# EasyEDA Pro project New Project_2023-08-31_08-25-03.eprj

# Schematic Schematic1
Create Date: 2023-08-31; Page Name: P1; Project Name: New Project_2023-08-31_08-25-03; Schematic Name: Schematic1; Update Date: 2023-08-31; Company: EasyEDA.com; Drawed: EasyEDA Pro; Page Size: A4; Part Number: JLCPCB-002; Reviewed: EasyEDA Pro; Version: V0.1
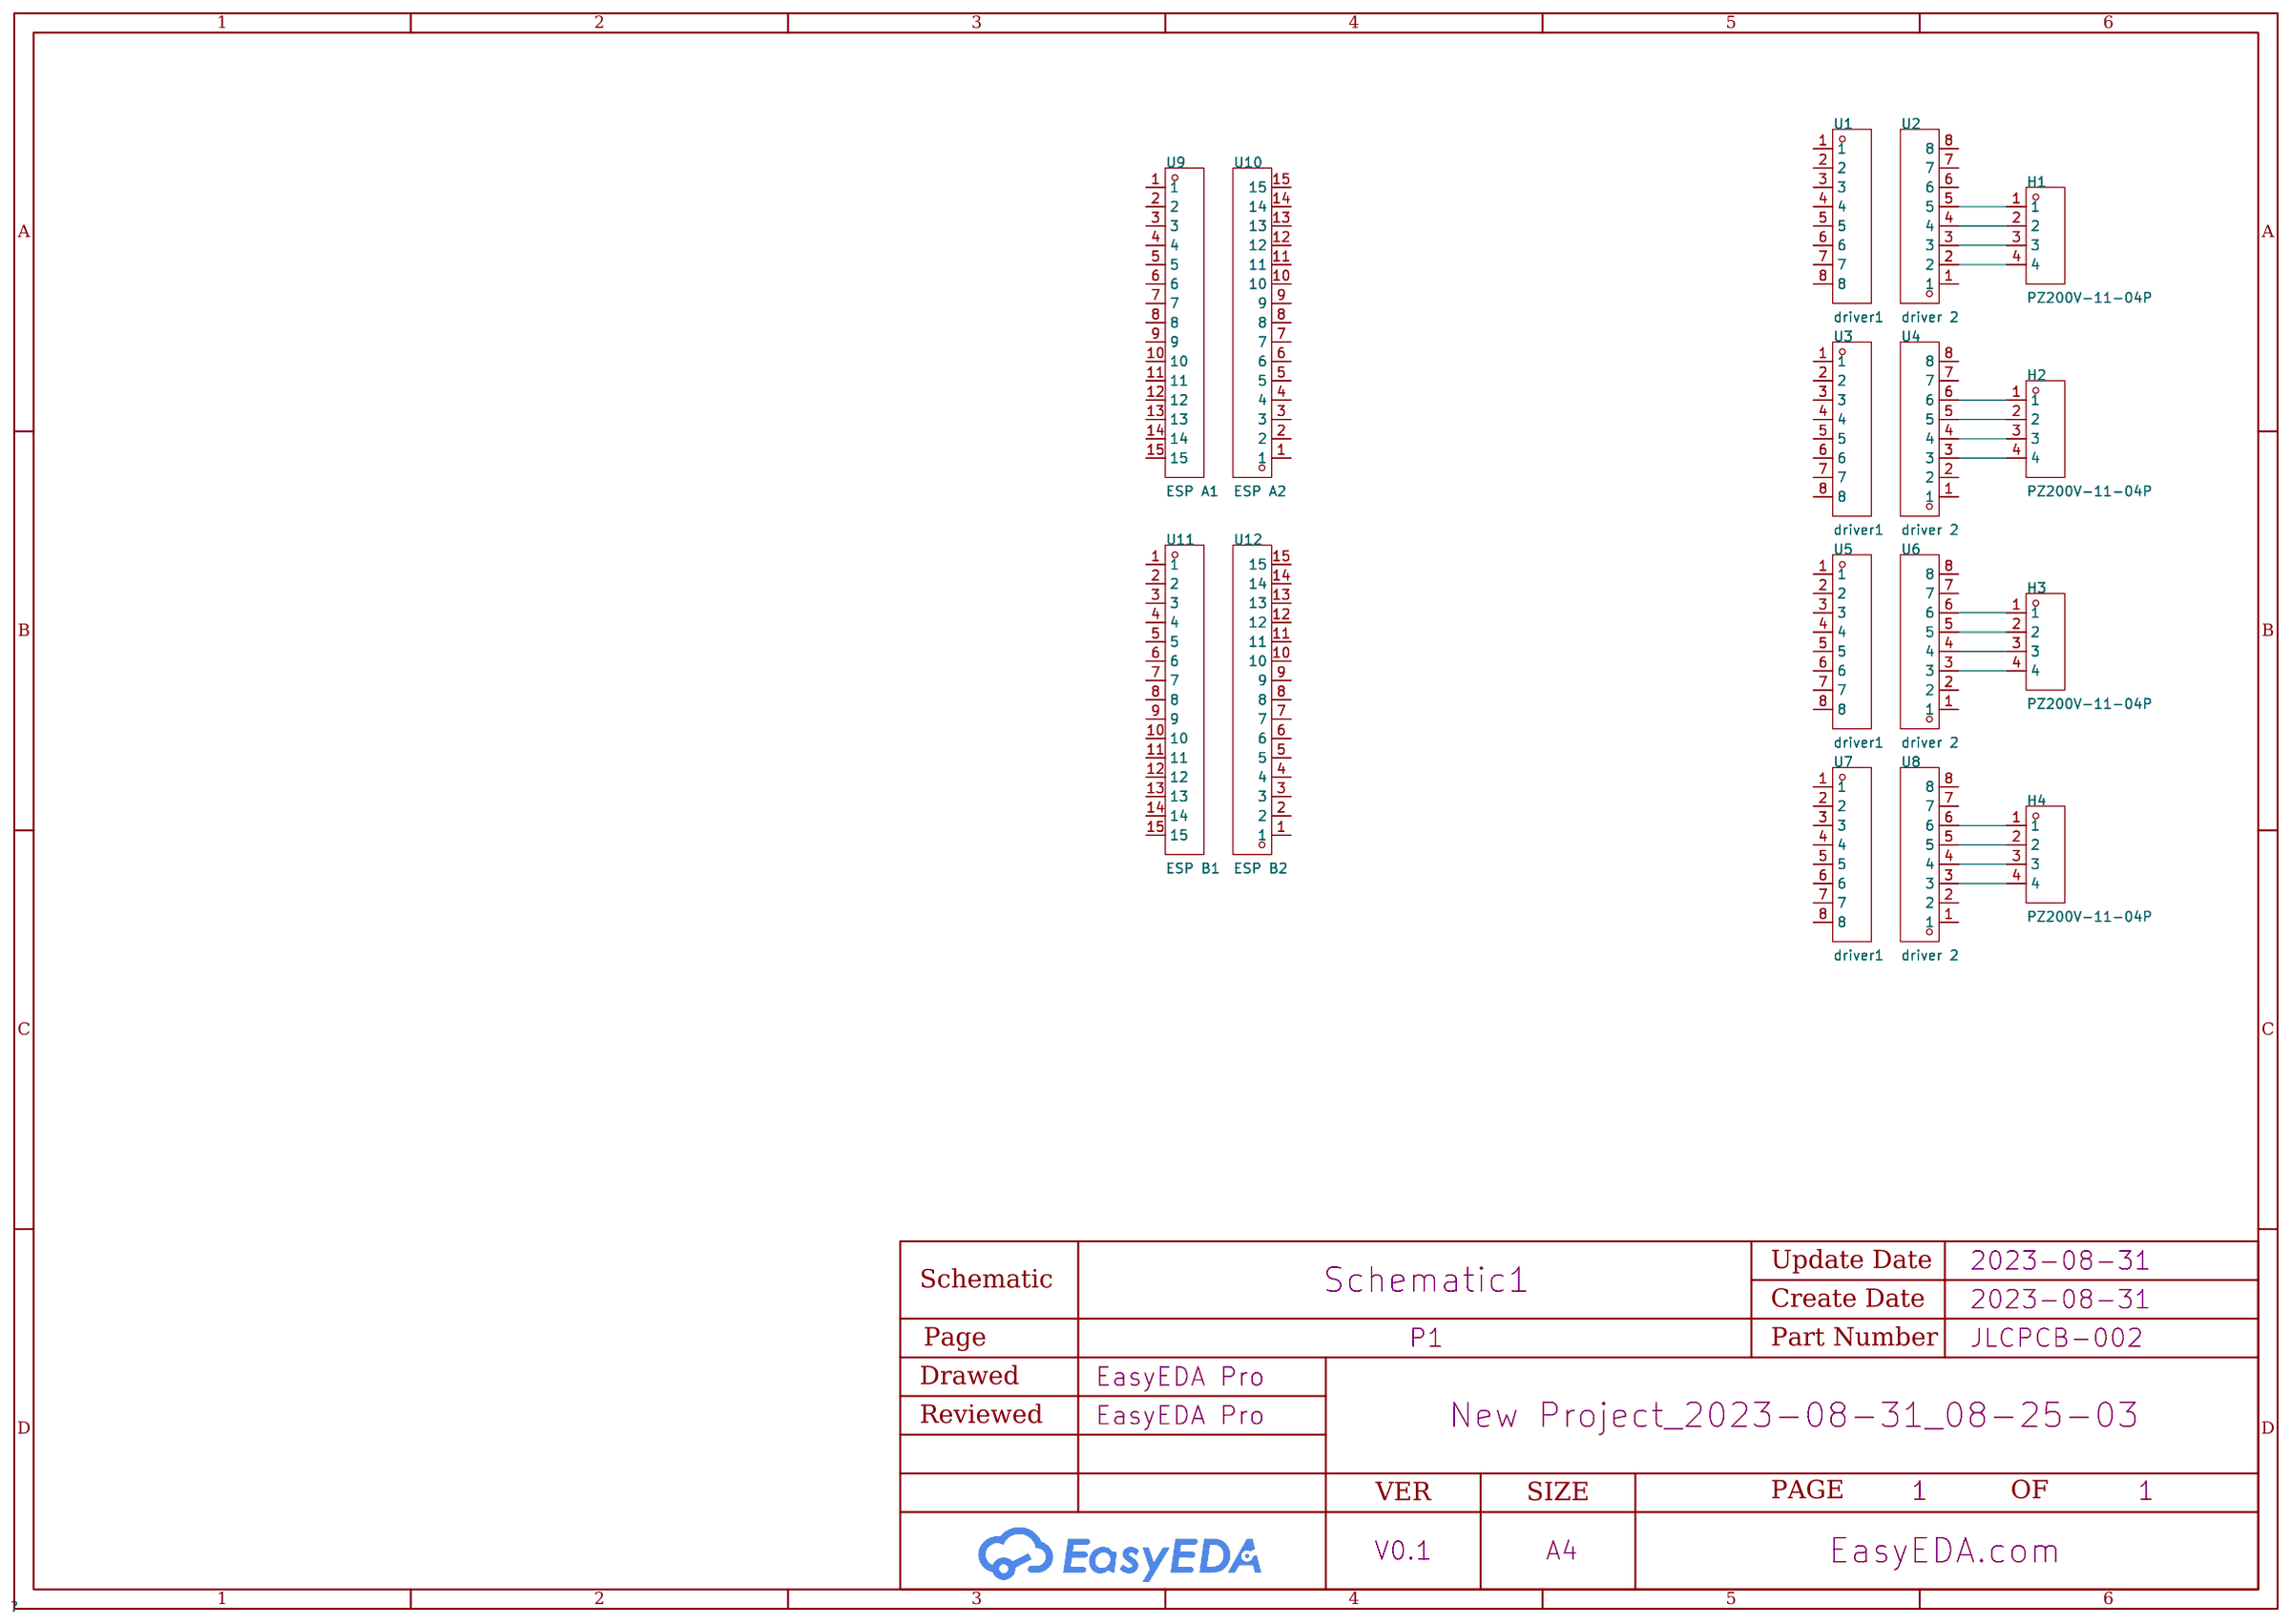
[diagram p0: schematic sheet]

## Parts
H1  PZ200V-11-04P  [HDR-TH_4P-P2.00-V-M]
H2  PZ200V-11-04P  [HDR-TH_4P-P2.00-V-M]
H3  PZ200V-11-04P  [HDR-TH_4P-P2.00-V-M]
H4  PZ200V-11-04P  [HDR-TH_4P-P2.00-V-M]
U1  driver1  [HDR-TH_8P-P2.54-V-F]
U2  driver 2  [HDR-TH_8P-P2.54-V-F]
U3  driver1  [HDR-TH_8P-P2.54-V-F]
U4  driver 2  [HDR-TH_8P-P2.54-V-F]
U5  driver1  [HDR-TH_8P-P2.54-V-F]
U6  driver 2  [HDR-TH_8P-P2.54-V-F]
U7  driver1  [HDR-TH_8P-P2.54-V-F]
U8  driver 2  [HDR-TH_8P-P2.54-V-F]
U9  ESP A1  [HDR-TH_15P-P2.54-V-F]
U10  ESP A2  [HDR-TH_15P-P2.54-V-F]
U11  ESP B1  [HDR-TH_15P-P2.54-V-F]
U12  ESP B2  [HDR-TH_15P-P2.54-V-F]

## Library data of the parts
H1-H4 = PZ200V-11-04P: Number of Rows:单排 Number of Pins:4 Pitch:2mm Pin Structure:1x4P Row Spacing:- Mounting Type:Straight Circluar Pins/Square Pins:Square Pins Current Rating (Max):- Voltage Rating (Max):- Length of Mating Pin:3.9mm Insulation Height:2mm Length of End Connect; LCSC Part Name: 2mm 1x4P 直插 方针; Supplier Part: C541858; Manufacturer: XFCN(兴飞); Supplier Footprint: 直插,P=2mm; JLCPCB Part Class: Extended Part; Supplier: LCSC; Number of Rows: 单排; Number of Pins: 4; Pitch: 2mm; Pin Structure: 1x4P; Mounting Type: Straight; Circluar Pins/Square Pins: Square Pins; Length of Mating Pin: 3.9mm; Insulation Height: 2mm; Length of End Connection Pin: 2.8mm; Operating Temperature Range: -40℃~+105℃; Color: Black
U1-U8 = FH-00882: Number of Rows:单排 Number of Holes:8 Pitch:2.54mm Holes Structure:1x8P Row Spacing:- Mounting Type:Straight Circular Hole / Square Hole:Square Holes Current Rating (Max):3A Voltage Rating (Max):- Holes Direction:Top Insulation Height:8.5mm Operating Temper; LCSC Part Name: 2.54mm 1x8P; Supplier Part: C2685213; Manufacturer: Liansheng(连盛); Supplier Footprint: 直插,P=2.54mm; JLCPCB Part Class: Extended Part; Supplier: LCSC; Number of Rows: 单排; Number of Holes: 8; Pitch: 2.54mm; Holes Structure: 1x8P; Mounting Type: Straight; Circular Hole / Square Hole: Square Holes; Current Rating (Max): 3A; Holes Direction: Top; Insulation Height: 8.5mm; Operating Temperature Range: -40℃~+105℃
U9-U12 = PM2.54-1*15: LCSC Part Name: 排母2.54 1*15 镀金环保; Supplier Part: C5371989; Manufacturer: ZHOURI(洲日); Supplier Footprint: 插件,P=2.54mm; Datasheet: https://atta.szlcsc.com/upload/public/pdf/source/20220729/3385E3C3A9122AF204A83235A2975C64.pdf; Supplier: LCSC

## Nets
Net-(H1-1): H1.1 U2.5
Net-(H1-2): H1.2 U2.4
Net-(H1-3): H1.3 U2.3
Net-(H1-4): H1.4 U2.2
Net-(H2-1): H2.1 U4.6
Net-(H2-2): H2.2 U4.5
Net-(H2-3): H2.3 U4.4
Net-(H2-4): H2.4 U4.3
Net-(H3-1): H3.1 U6.6
Net-(H3-2): H3.2 U6.5
Net-(H3-3): H3.3 U6.4
Net-(H3-4): H3.4 U6.3
Net-(H4-1): H4.1 U8.6
Net-(H4-2): H4.2 U8.5
Net-(H4-3): H4.3 U8.4
Net-(H4-4): H4.4 U8.3

Not connected (* = marked no-connect by the designer): U1 1 2 3 4 5 6 7 8; U2 1 6 7 8; U3 1 2 3 4 5 6 7 8; U4 1 2 7 8; U5 1 2 3 4 5 6 7 8; U6 1 2 7 8; U7 1 2 3 4 5 6 7 8; U8 1 2 7 8; U9 1 2 3 4 5 6 7 8 9 10 11 12 13 14 15; U10 1 2 3 4 5 6 7 8 9 10 11 12 13 14 15; U11 1 2 3 4 5 6 7 8 9 10 11 12 13 14 15; U12 1 2 3 4 5 6 7 8 9 10 11 12 13 14 15
